# EasyEDA schematic SCH_led+button_2026-04-27.json
TITLE: Sheet_1; REV: 1.0; Date: 2026-04-27; Sheet: 1/1; Drawn By: kristina112; Company: Your Company
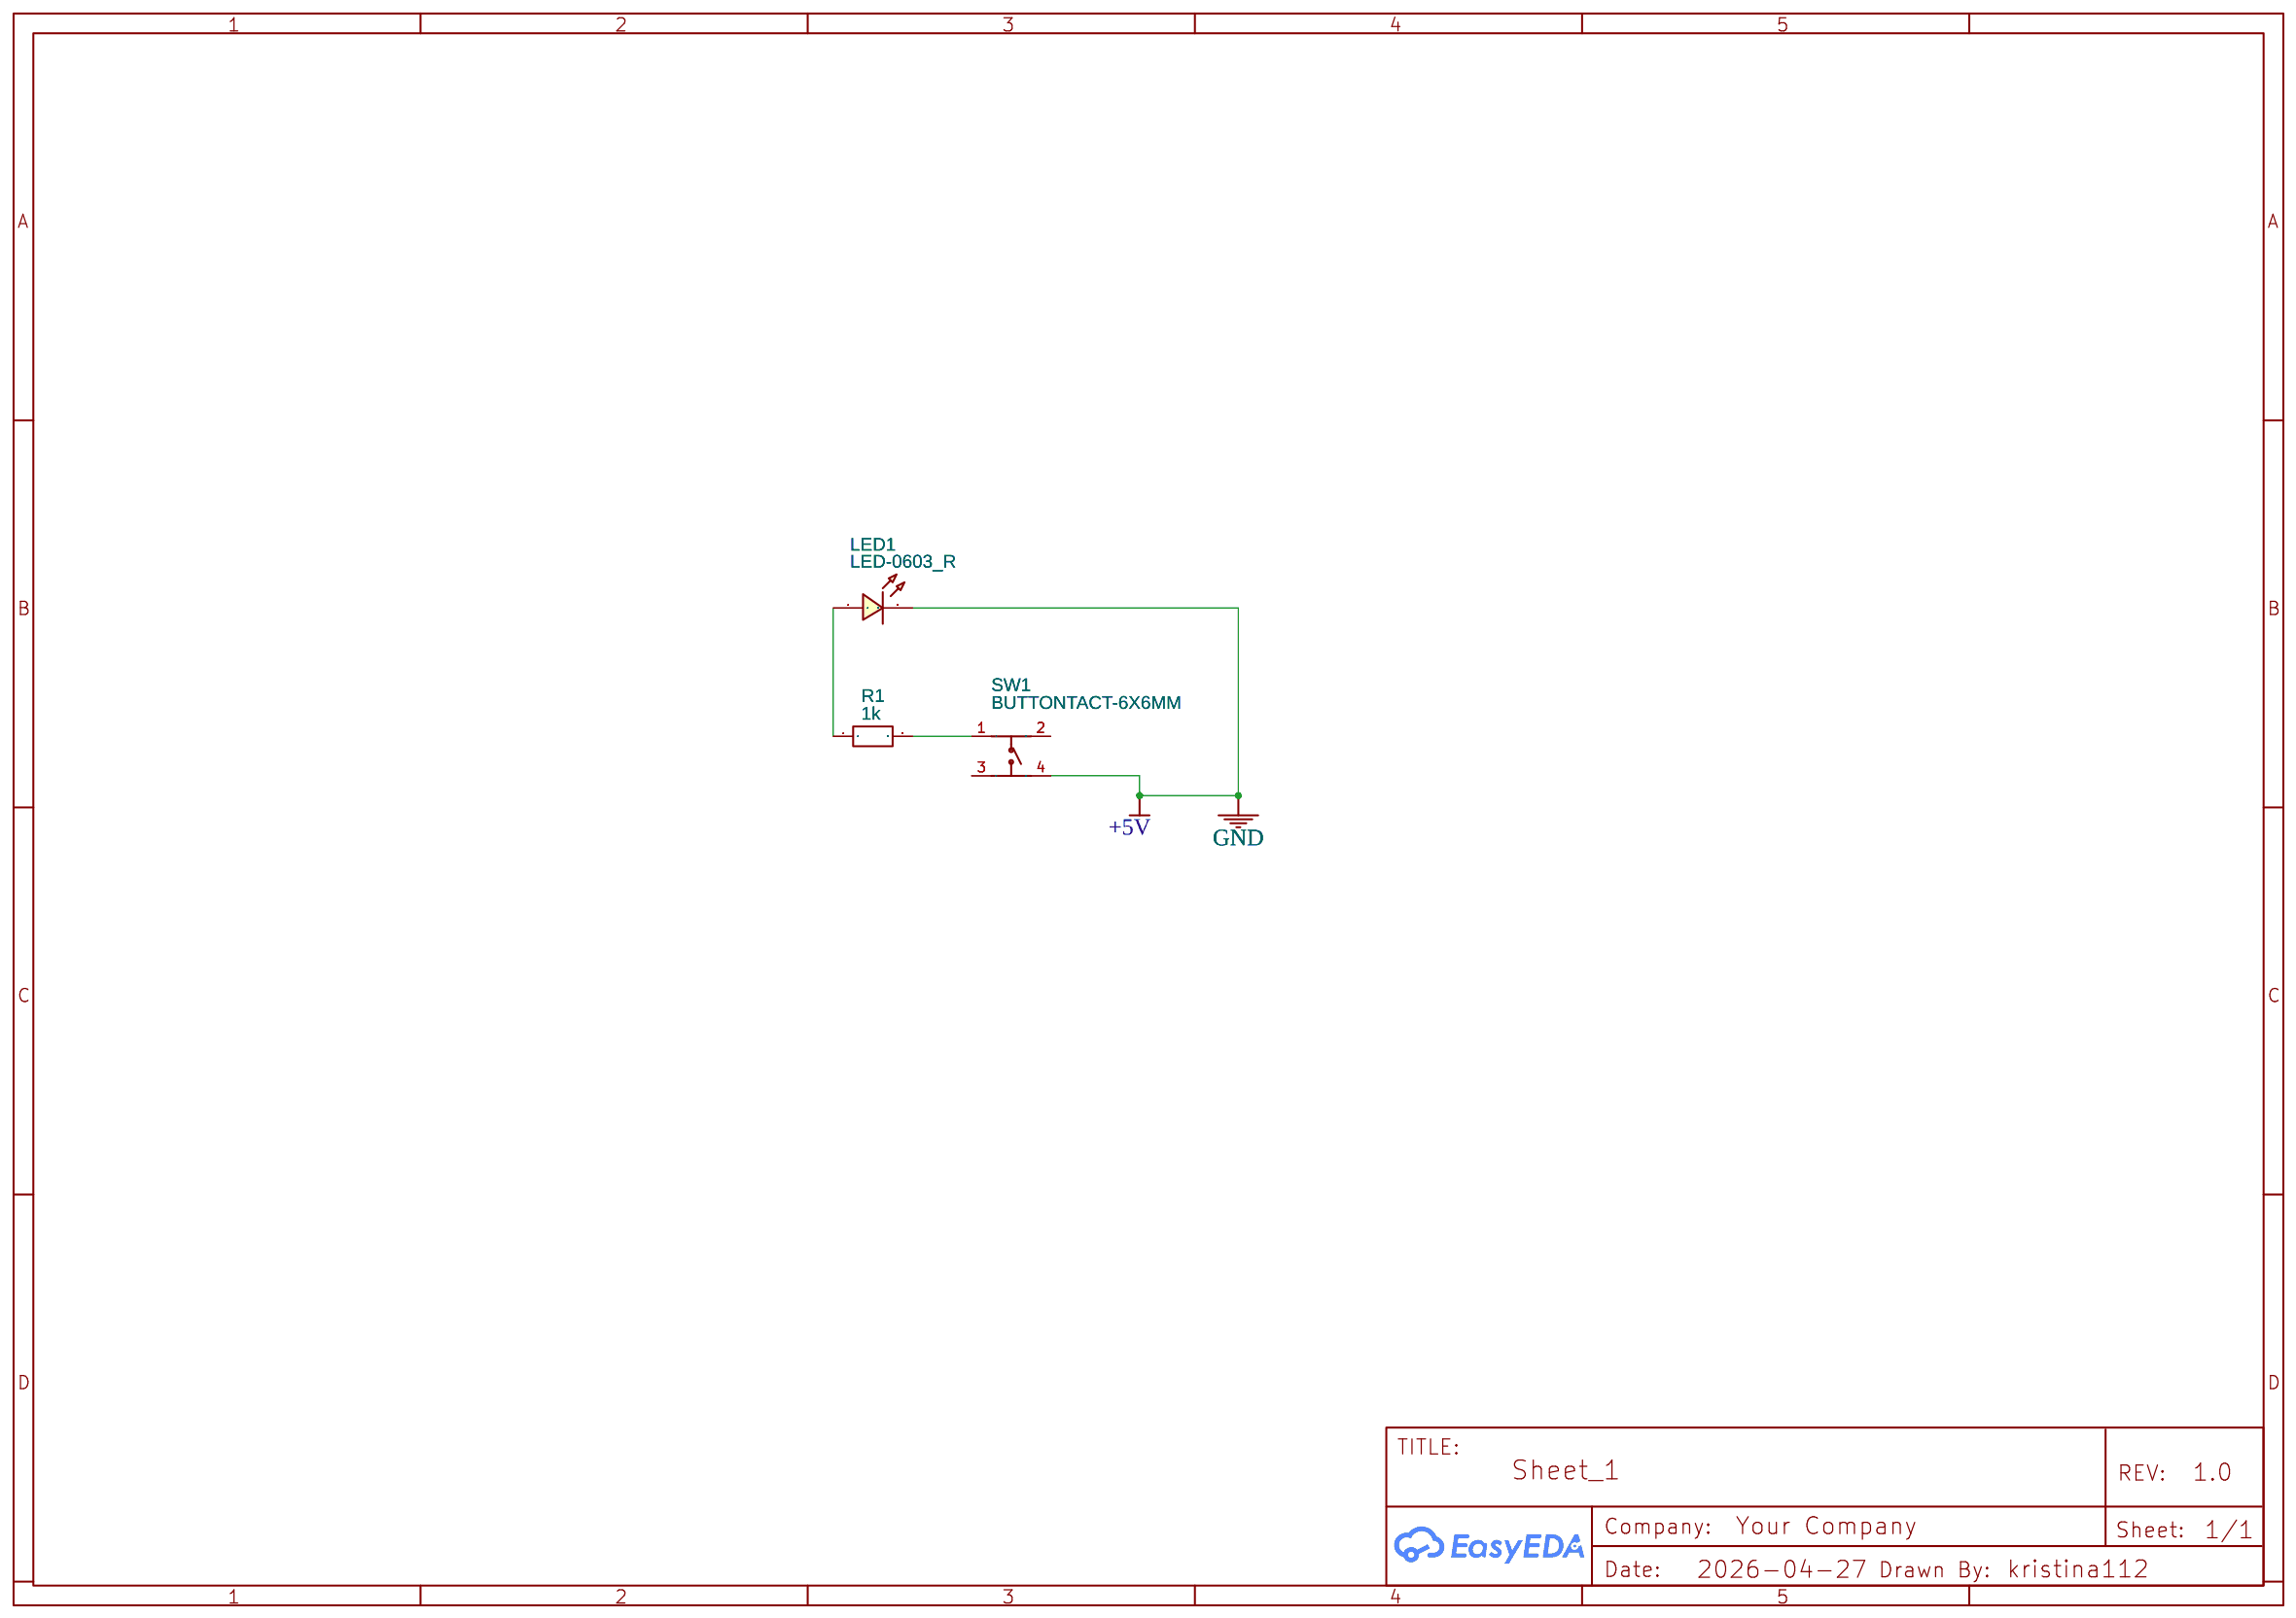
[diagram p0: schematic sheet]

## Parts
LED1  LED-0603_R  [LED0603_RED]
R1  1k  [R0603]
SW1  BUTTONTACT-6X6MM  [SW-SMD_4P-L6.0-W6.0-P4.50-LS9.2]

## Library data of the parts
LED1 = LED-0603_R: Manufacturer: EVERLIGHT(台湾亿光); Manufacturer Part: 19-217/R6C-AL1M2VY/3T; Supplier Part: C72044; Supplier: LCSC; Contributor: LCEDA_01
R1 = R_0603_EU: Contributor: LCEDA_Lib
SW1 = BUTTONTACT-6X6MM: Contributor: LCSC; Supplier: LCSC; Supplier Part: C9900004221; Manufacturer Part: Buttontact-6x6mm; Manufacturer: null; JLCPCB Part Class: Extended Part

## Nets
+5V: LED1.2 SW1.4(D)
Net-(LED1-1): LED1.1 R1.1
Net-(R1-2): R1.2 SW1.1(A)

Not connected (* = marked no-connect by the designer): SW1 2(B) 3(C)
